# Altium schematic sheet EDU_High-Speed-Design_CPU.SchDoc: CPU
size 431 x 279 mm; Date: not used; ApprovedBy: not used; CheckedBy: not used; Author: not used; DrawnBy: not used; Organization: not used; Address4: not used; SheetNumber: 11; SheetTotal: 26; Time: not used; ImagePath: not used; Application_BuildNumber: not used
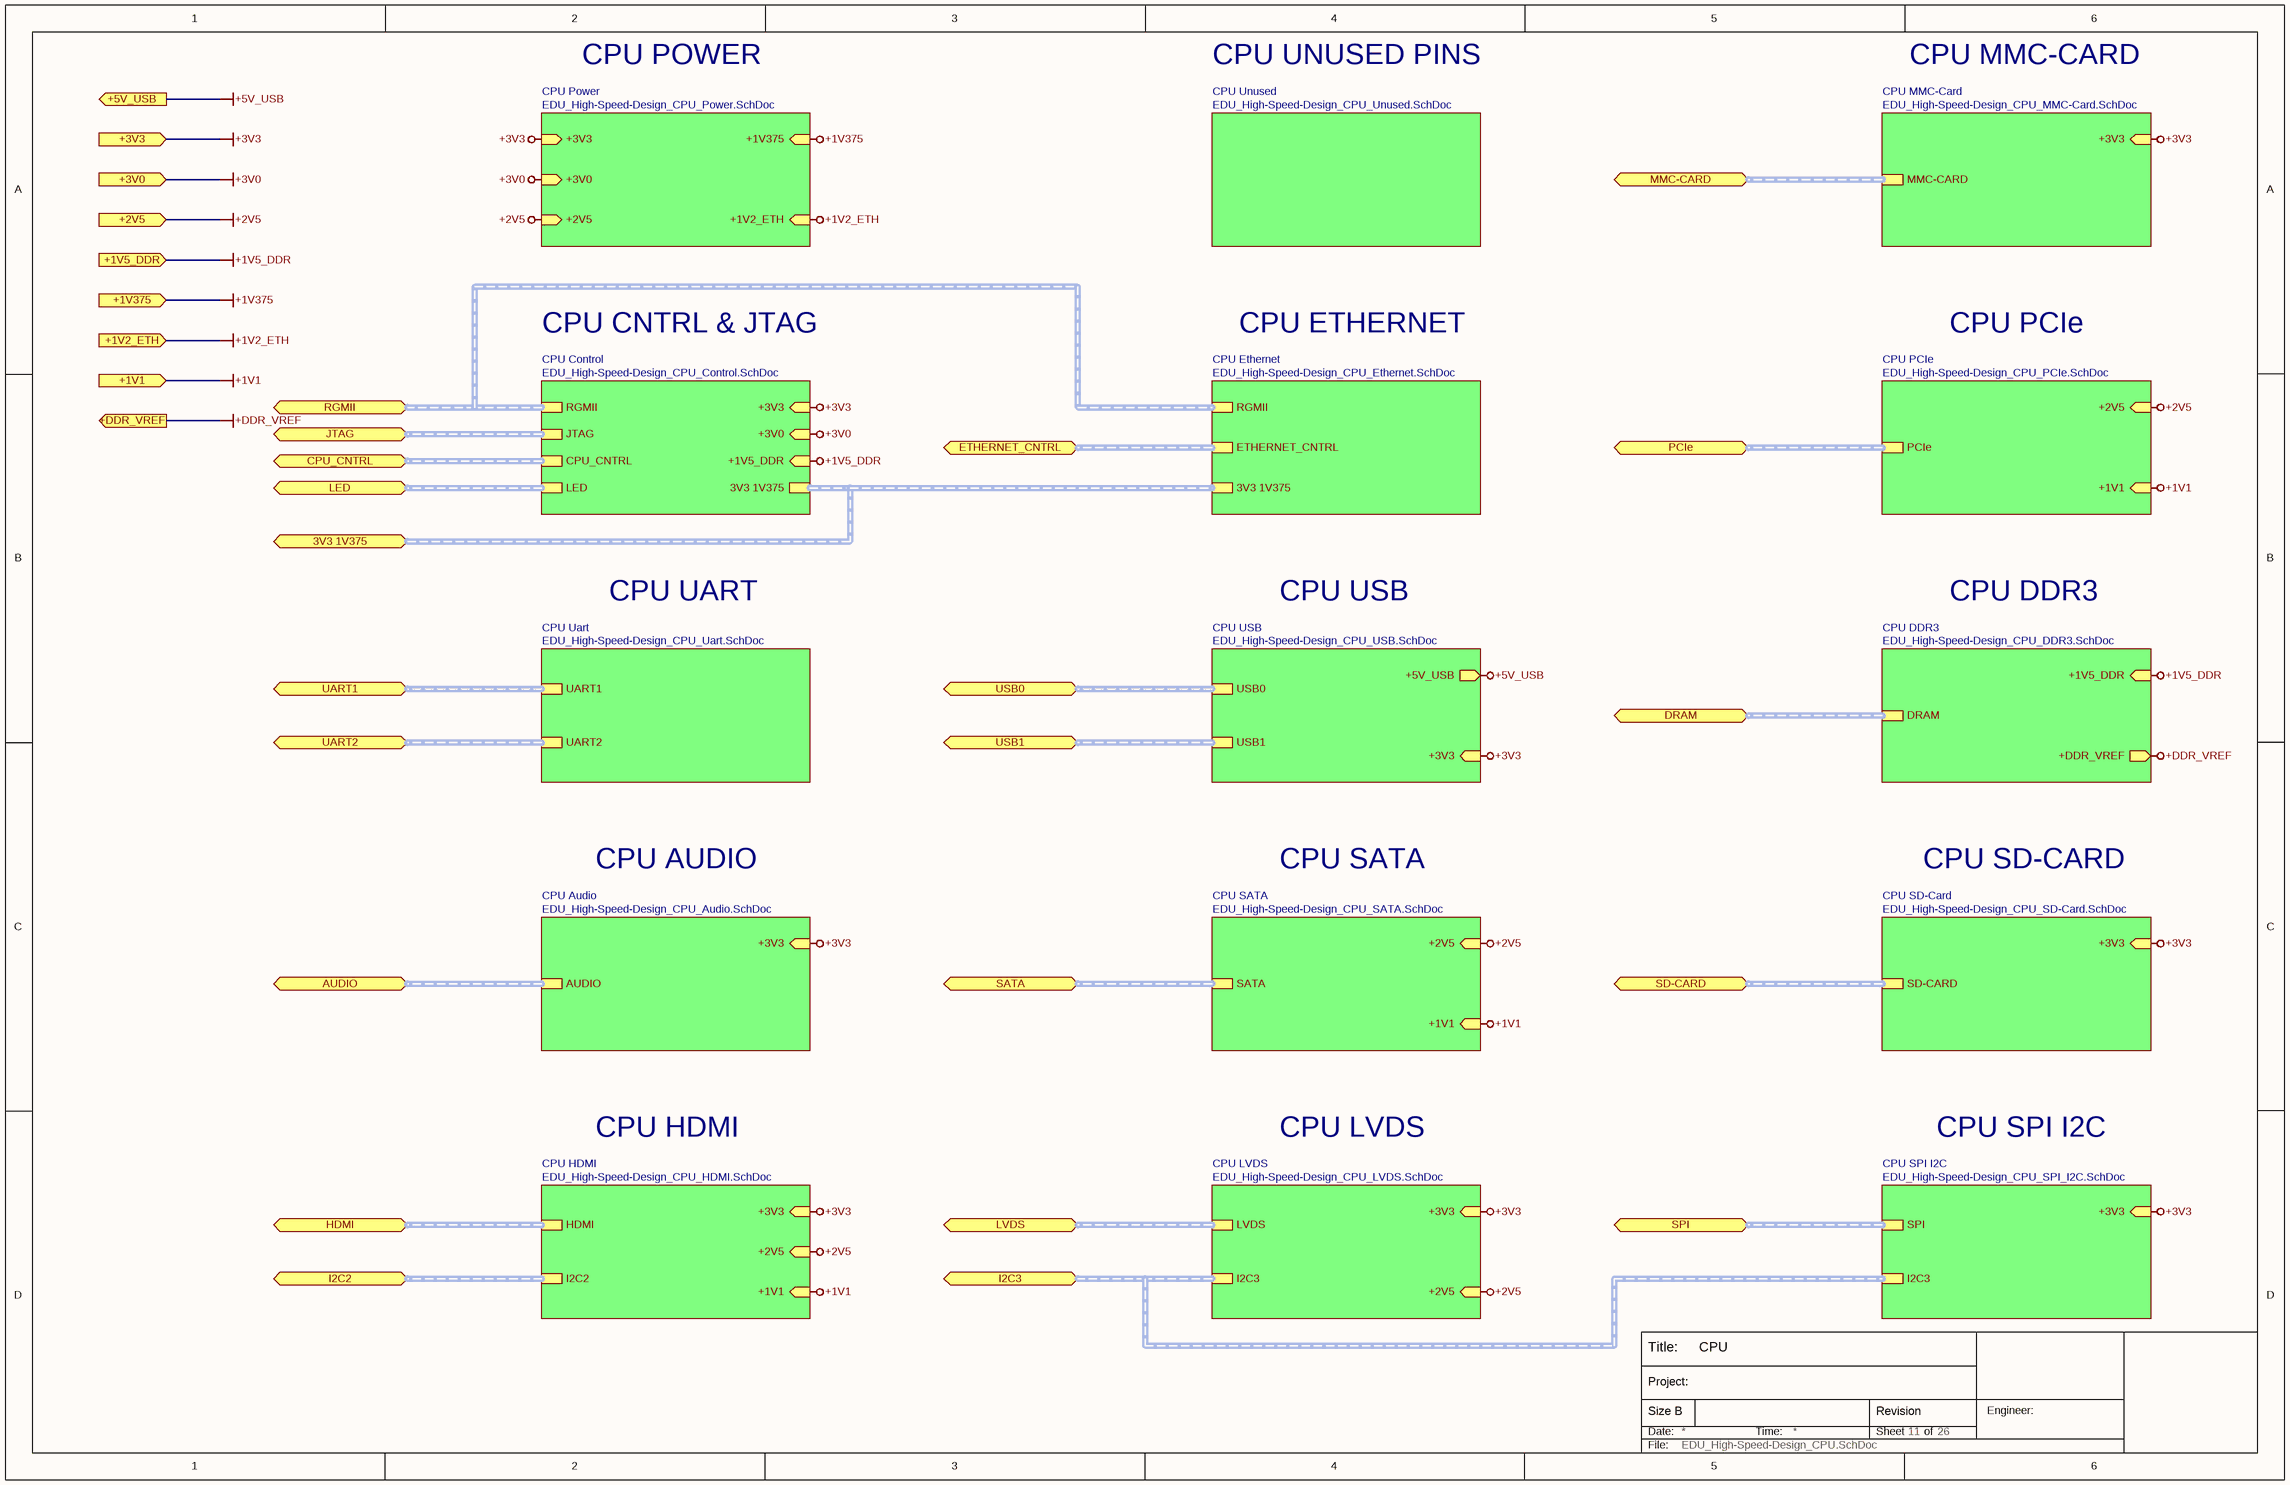
[diagram p0: EDU_High-Speed-Design_CPU.SchDoc]

## Sub-sheets
CPU Audio = EDU_High-Speed-Design_CPU_Audio.SchDoc: AUDIO (harness AUDIO), +3V3 (in)
CPU Control = EDU_High-Speed-Design_CPU_Control.SchDoc: RGMII (harness RGMII), JTAG (harness JTAG), CPU_CNTRL (harness CPU_CNTRL), LED (harness LED), +3V3 (in), +3V0 (in), +1V5_DDR (in), 3V3 1V375 (harness 3V3 1V375)
CPU DDR3 = EDU_High-Speed-Design_CPU_DDR3.SchDoc: DRAM (harness DRAM), +1V5_DDR (in), +DDR_VREF (out)
CPU Ethernet = EDU_High-Speed-Design_CPU_Ethernet.SchDoc: RGMII (harness RGMII), ETHERNET_CNTRL (harness ETHERNET_CNTRL), 3V3 1V375 (harness 3V3 1V375)
CPU HDMI = EDU_High-Speed-Design_CPU_HDMI.SchDoc: HDMI (harness HDMI), +3V3 (in), I2C2 (harness I2C2), +2V5 (in), +1V1 (in)
CPU LVDS = EDU_High-Speed-Design_CPU_LVDS.SchDoc: LVDS (harness LVDS), I2C3 (harness I2C3), +3V3 (in), +2V5 (in)
CPU MMC-Card = EDU_High-Speed-Design_CPU_MMC-Card.SchDoc: MMC-CARD (harness MMC-CARD), +3V3 (in)
CPU PCIe = EDU_High-Speed-Design_CPU_PCIe.SchDoc: PCIe (harness PCIe), +2V5 (in), +1V1 (in)
CPU Power = EDU_High-Speed-Design_CPU_Power.SchDoc: +3V3 (in), +3V0 (in), +2V5 (in), +1V375 (in), +1V2_ETH (in)
CPU SATA = EDU_High-Speed-Design_CPU_SATA.SchDoc: SATA (harness SATA), +2V5 (in), +1V1 (in)
CPU SD-Card = EDU_High-Speed-Design_CPU_SD-Card.SchDoc: SD-CARD (harness SD-CARD), +3V3 (in)
CPU SPI I2C = EDU_High-Speed-Design_CPU_SPI_I2C.SchDoc: SPI (harness SPI), I2C3 (harness I2C3), +3V3 (in)
CPU Uart = EDU_High-Speed-Design_CPU_Uart.SchDoc: UART1 (harness UART1), UART2 (harness UART2)
CPU Unused = EDU_High-Speed-Design_CPU_Unused.SchDoc: no entries
CPU USB = EDU_High-Speed-Design_CPU_USB.SchDoc: USB0 (harness USB0), USB1 (harness USB1), +5V_USB (out), +3V3 (in)

## Ports
3V3 1V375 (bidir, harness 3V3 1V375), +1V1 (in), +1V2_ETH (in), +1V5_DDR (in), +1V375 (in), +2V5 (in), +3V0 (in), +3V3 (in), +5V_USB (out), +DDR_VREF (out), AUDIO (bidir, harness AUDIO), CPU_CNTRL (bidir, harness CPU_CNTRL), DRAM (bidir, harness DRAM), ETHERNET_CNTRL (bidir, harness ETHERNET_CNTRL), HDMI (bidir, harness HDMI), I2C2 (bidir, harness I2C2), I2C3 (bidir, harness I2C3), JTAG (bidir, harness JTAG), LED (bidir, harness LED), LVDS (bidir, harness LVDS), MMC-CARD (bidir, harness MMC-CARD), PCIe (bidir, harness PCIe), RGMII (bidir, harness RGMII), SATA (bidir, harness SATA), SD-CARD (bidir, harness SD-CARD), SPI (bidir, harness SPI), UART1 (bidir, harness UART1), UART2 (bidir, harness UART2), USB0 (bidir, harness USB0), USB1 (bidir, harness USB1)

## Nets
+1V1: port +1V1, sheet CPU HDMI/+1V1, sheet CPU PCIe/+1V1, sheet CPU SATA/+1V1
+1V2_ETH: port +1V2_ETH, sheet CPU Power/+1V2_ETH
+1V5_DDR: port +1V5_DDR, sheet CPU Control/+1V5_DDR, sheet CPU DDR3/+1V5_DDR
+1V375: port +1V375, sheet CPU Power/+1V375
+2V5: port +2V5, sheet CPU Power/+2V5, sheet CPU LVDS/+2V5, sheet CPU HDMI/+2V5, sheet CPU PCIe/+2V5, sheet CPU SATA/+2V5
+3V0: port +3V0, sheet CPU Power/+3V0, sheet CPU Control/+3V0
+3V3: port +3V3, sheet CPU Power/+3V3, sheet CPU Control/+3V3, sheet CPU Audio/+3V3, sheet CPU USB/+3V3, sheet CPU LVDS/+3V3, sheet CPU HDMI/+3V3, sheet CPU SD-Card/+3V3, sheet CPU MMC-Card/+3V3, sheet CPU SPI I2C/+3V3
+5V_USB: port +5V_USB, sheet CPU USB/+5V_USB
+DDR_VREF: port +DDR_VREF, sheet CPU DDR3/+DDR_VREF

## Buses and harness runs
harness port 3V3 1V375 = sheet CPU Control/3V3 1V375 = sheet CPU Ethernet/3V3 1V375
harness port AUDIO = sheet CPU Audio/AUDIO
harness port CPU_CNTRL = sheet CPU Control/CPU_CNTRL
harness port DRAM = sheet CPU DDR3/DRAM
harness port ETHERNET_CNTRL = sheet CPU Ethernet/ETHERNET_CNTRL
harness port HDMI = sheet CPU HDMI/HDMI
harness port I2C2 = sheet CPU HDMI/I2C2
harness port I2C3 = sheet CPU LVDS/I2C3 = sheet CPU SPI I2C/I2C3
harness port JTAG = sheet CPU Control/JTAG
harness port LED = sheet CPU Control/LED
harness port LVDS = sheet CPU LVDS/LVDS
harness port MMC-CARD = sheet CPU MMC-Card/MMC-CARD
harness port PCIe = sheet CPU PCIe/PCIe
harness port RGMII = sheet CPU Control/RGMII = sheet CPU Ethernet/RGMII
harness port SATA = sheet CPU SATA/SATA
harness port SD-CARD = sheet CPU SD-Card/SD-CARD
harness port SPI = sheet CPU SPI I2C/SPI
harness port UART1 = sheet CPU Uart/UART1
harness port UART2 = sheet CPU Uart/UART2
harness port USB0 = sheet CPU USB/USB0
harness port USB1 = sheet CPU USB/USB1

## Notes on the sheet
- CPU POWER
- CPU UNUSED PINS
- CPU MMC-CARD
- CPU CNTRL & JTAG
- CPU ETHERNET
- CPU PCIe
- CPU UART
- CPU USB
- CPU DDR3
- CPU AUDIO
- CPU SATA
- CPU SD-CARD
- CPU HDMI
- CPU LVDS
- CPU SPI I2C
- Title:
- Date:
- Size B
- Project:
- Time:
- Sheet
- Revision
- of
- Engineer:
- File: